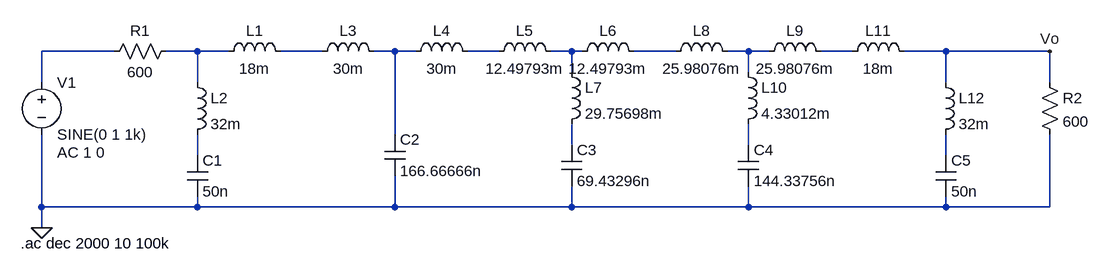
[diagram p0: schematic ej10.asc]
ej10.asc, the LTspice schematic file:
Version 4
SHEET 1 1604 680
WIRE 96 64 -16 64
WIRE 224 64 176 64
WIRE 272 64 224 64
WIRE 416 64 352 64
WIRE 528 64 496 64
WIRE 560 64 528 64
WIRE 688 64 640 64
WIRE 800 64 768 64
WIRE 816 64 800 64
WIRE 960 64 896 64
WIRE 1072 64 1040 64
WIRE 1104 64 1072 64
WIRE 1232 64 1184 64
WIRE 1376 64 1312 64
WIRE 1536 64 1376 64
WIRE 800 96 800 64
WIRE 1072 96 1072 64
WIRE -16 112 -16 64
WIRE 224 112 224 64
WIRE 1376 112 1376 64
WIRE 1536 112 1536 64
WIRE 528 192 528 64
WIRE 800 208 800 176
WIRE 1072 208 1072 176
WIRE 224 224 224 192
WIRE 1376 224 1376 192
WIRE -16 304 -16 192
WIRE 224 304 224 288
WIRE 224 304 -16 304
WIRE 528 304 528 256
WIRE 528 304 224 304
WIRE 800 304 800 272
WIRE 800 304 528 304
WIRE 1072 304 1072 272
WIRE 1072 304 800 304
WIRE 1376 304 1376 288
WIRE 1376 304 1072 304
WIRE 1536 304 1536 192
WIRE 1536 304 1376 304
WIRE -16 336 -16 304
FLAG -16 336 0
FLAG 1536 64 Vo
SYMBOL voltage -16 96 R0
WINDOW 123 24 124 Left 2
WINDOW 39 0 0 Left 0
SYMATTR InstName V1
SYMATTR Value SINE(0 1 1k)
SYMATTR Value2 AC 1 0
SYMBOL res 192 48 R90
WINDOW 0 0 56 VBottom 2
WINDOW 3 32 56 VTop 2
SYMATTR InstName R1
SYMATTR Value 600
SYMBOL ind 256 80 R270
WINDOW 0 32 56 VTop 2
WINDOW 3 5 56 VBottom 2
SYMATTR InstName L1
SYMATTR Value 18m
SYMBOL ind 208 96 R0
SYMATTR InstName L2
SYMATTR Value 32m
SYMBOL ind 400 80 R270
WINDOW 0 32 56 VTop 2
WINDOW 3 5 56 VBottom 2
SYMATTR InstName L3
SYMATTR Value 30m
SYMBOL ind 544 80 R270
WINDOW 0 32 56 VTop 2
WINDOW 3 5 56 VBottom 2
SYMATTR InstName L4
SYMATTR Value 30m
SYMBOL ind 672 80 R270
WINDOW 0 32 56 VTop 2
WINDOW 3 5 56 VBottom 2
SYMATTR InstName L5
SYMATTR Value 12.49793m
SYMBOL ind 800 80 R270
WINDOW 0 32 56 VTop 2
WINDOW 3 5 56 VBottom 2
SYMATTR InstName L6
SYMATTR Value 12.49793m
SYMBOL ind 784 80 R0
SYMATTR InstName L7
SYMATTR Value 29.75698m
SYMBOL ind 944 80 R270
WINDOW 0 32 56 VTop 2
WINDOW 3 5 56 VBottom 2
SYMATTR InstName L8
SYMATTR Value 25.98076m
SYMBOL ind 1088 80 R270
WINDOW 0 32 56 VTop 2
WINDOW 3 5 56 VBottom 2
SYMATTR InstName L9
SYMATTR Value 25.98076m
SYMBOL cap 208 224 R0
SYMATTR InstName C1
SYMATTR Value 50n
SYMBOL cap 512 192 R0
SYMATTR InstName C2
SYMATTR Value 166.66666n
SYMBOL cap 784 208 R0
SYMATTR InstName C3
SYMATTR Value 69.43296n
SYMBOL ind 1056 80 R0
SYMATTR InstName L10
SYMATTR Value 4.33012m
SYMBOL cap 1056 208 R0
SYMATTR InstName C4
SYMATTR Value 144.33756n
SYMBOL ind 1216 80 R270
WINDOW 0 32 56 VTop 2
WINDOW 3 5 56 VBottom 2
SYMATTR InstName L11
SYMATTR Value 18m
SYMBOL ind 1360 96 R0
SYMATTR InstName L12
SYMATTR Value 32m
SYMBOL cap 1360 224 R0
SYMATTR InstName C5
SYMATTR Value 50n
SYMBOL res 1520 96 R0
SYMATTR InstName R2
SYMATTR Value 600
TEXT -48 360 Left 2 !.ac dec 2000 10 100k

The netlist it stands for:
* ej10.asc
V1 N001 0 SINE(0 1 1k) AC 1 0
R1 N002 N001 600
L1 N002 N003 18m
L2 N002 N012 32m
L3 N003 N004 30m
L4 N004 N005 30m
L5 N005 N006 12.49793m
L6 N006 N007 12.49793m
L7 N006 N010 29.75698m
L8 N007 N008 25.98076m
L9 N008 N009 25.98076m
C1 N012 0 50n
C2 N004 0 166.66666n
C3 N010 0 69.43296n
L10 N008 N011 4.33012m
C4 N011 0 144.33756n
L11 N009 Vo 18m
L12 Vo N013 32m
C5 N013 0 50n
R2 Vo 0 600
.ac dec 2000 10 100k
.backanno
.end